# Altium project mechanical_keyboard.PrjPcb
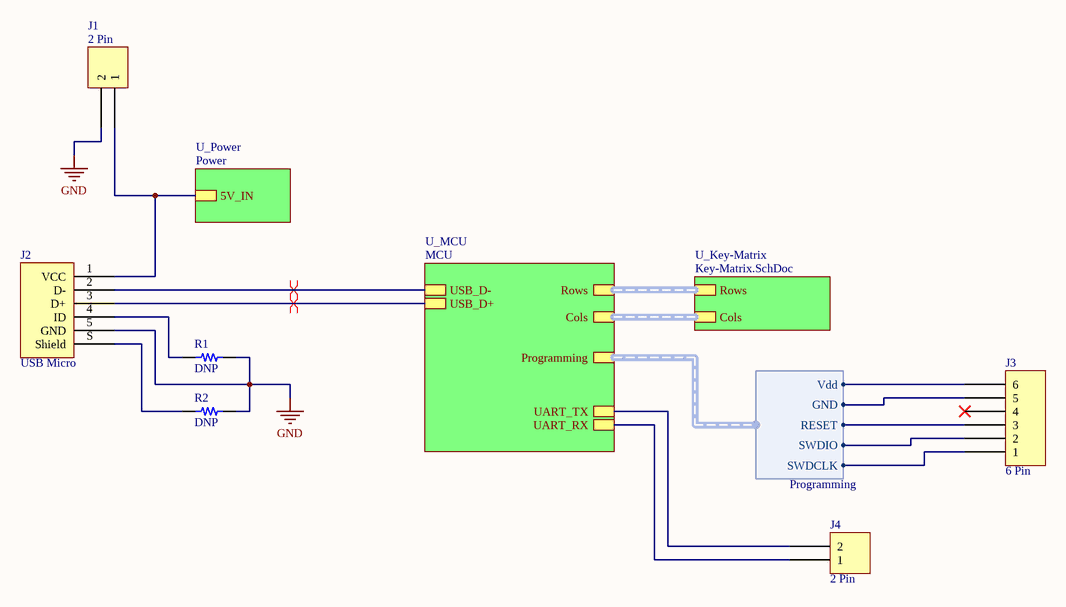
[diagram p0: Mechanical-Keyboard.SchDoc]
4 sheets, 52 parts. Net scope: hierarchical (ports join the sheet entries above them; power ports are global).
Board file: Mechanical-Keyboard.PcbDoc
Sheets:
  Mechanical-Keyboard.SchDoc
    U_MCU = MCU.SchDoc
    U_Power = Power.SchDoc
    U_Key-Matrix = Key-Matrix.SchDoc

## Sheet Mechanical-Keyboard.SchDoc
size A4; SheetTotal: 2

### Parts
J1  2 Pin  [HDR1X2]
J2  USB Micro  [FCI USB 10033526-N3212LF]
J3  6 Pin  [HDR1X6]
J4  2 Pin  [HDR1X2]
R1  DNP  [RES 0603_1608]
R2  DNP  [RES 0603_1608]

### Sub-sheets
U_Key-Matrix = Key-Matrix.SchDoc: Rows (harness Rows), Cols (harness Cols)
U_MCU = MCU: USB_D-, USB_D+, Rows (harness Rows), Cols (harness Rows), Programming (harness Programming), UART_TX, UART_RX
U_Power = Power: 5V_IN

### Harnesses
Programming: Vdd, GND, RESET, SWDIO, SWDCLK

### Nets
GND: J1.2 J2.5(GND) J3.5 R1.2 R2.2 ; sheet U_MCU/Programming.GND
Vdd: J3.6 ; sheet U_MCU/Programming.Vdd
RST: J3.3 ; sheet U_MCU/Programming.RESET
SWCLK: J3.1 ; sheet U_MCU/Programming.SWDCLK
SWDIO: J3.2 ; sheet U_MCU/Programming.SWDIO
USART3_RX: J4.1 ; sheet U_MCU/UART_RX
USART3_TX: J4.2 ; sheet U_MCU/UART_TX
USB_D_N: J2.2(D-) ; sheet U_MCU/USB_D-
USB_D_P: J2.3(D+) ; sheet U_MCU/USB_D+
NetC1_2: J1.1 J2.1(VCC) ; sheet U_Power/5V_IN
NetJ2_4: J2.4(ID) R1.1
NetJ2_S: J2.S(Shield) R2.1

Not connected (* = marked no-connect by the designer): J3 4*

### Buses and harness runs
harness sheet U_Key-Matrix/Cols = sheet U_MCU/Cols
harness sheet U_Key-Matrix/Rows = sheet U_MCU/Rows

### Layout directives
differential pair; differential pair class USB_PHY: USB_D_N, USB_D_P

### Library data of the parts
J2 = USB 2.0 Type B Micro
R1 R2 = Resistor: SMT Resistor

## Sheet MCU.SchDoc
size A4
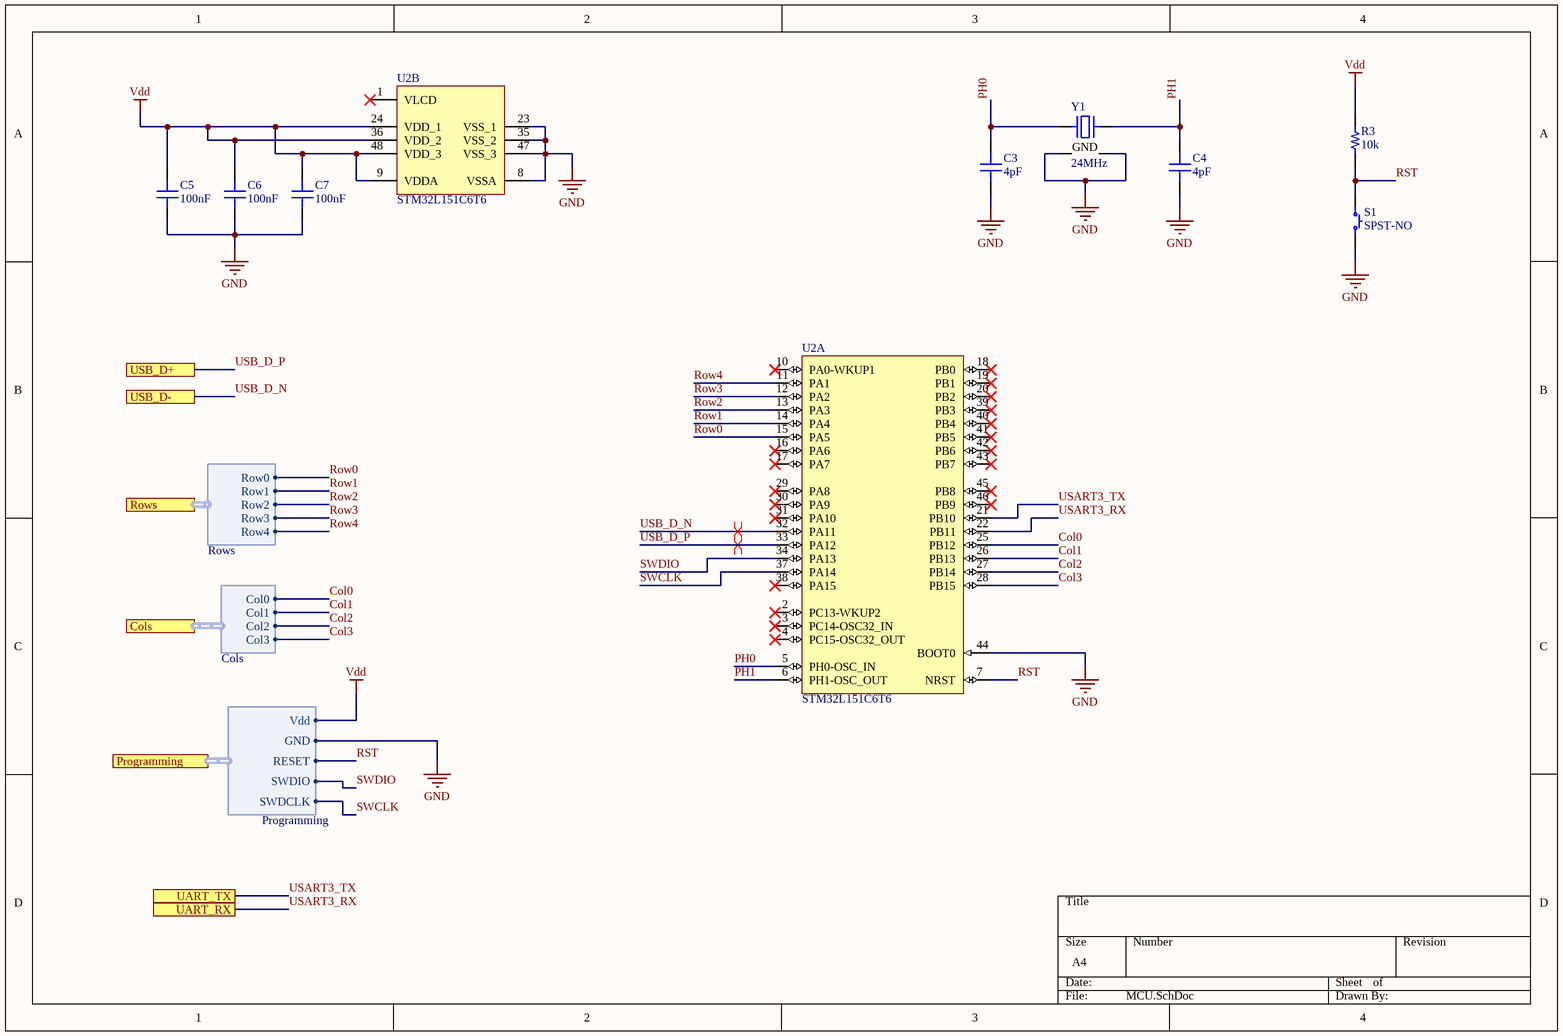
[diagram p1: MCU.SchDoc]

### Parts
C3  4pF  [CAP 0603_1608]
C4  4pF  [CAP 0603_1608]
C5  100nF  [CAP 0603_1608]
C6  100nF  [CAP 0603_1608]
C7  100nF  [CAP 0603_1608]
R3  10k  [RES 0603_1608]
S1  SPST-NO  [TE FSMSMTR]
U2  STM32L151C6T6  [STM-LQFP48_M]  (parts A,B of 2)
Y1  24MHz  [ABRACON ABM10]

### Ports
Cols (harness Cols), Programming (harness Programming), Rows (harness Rows), UART_RX, UART_TX, USB_D+, USB_D-

### Harnesses
Programming: Vdd, GND, RESET, SWDIO, SWDCLK
Rows: Row0, Row1, Row2, Row3, Row4
Cols: Col0, Col1, Col2, Col3

### Nets
GND: C3.1 C4.1 C5.1 C6.1 C7.1 S1.2 U2.8(VSSA) U2.23(VSS_1) U2.35(VSS_2) U2.44(BOOT0) U2.47(VSS_3) Y1.2(GND) Y1.4(GND) ; port Programming.GND
Vdd: C5.2 C6.2 C7.2 R3.2 U2.9(VDDA) U2.24(VDD_1) U2.36(VDD_2) U2.48(VDD_3) ; port Programming.Vdd
Col0: U2.25(PB12) ; port Cols.Col0
Col1: U2.26(PB13) ; port Cols.Col1
Col2: U2.27(PB14) ; port Cols.Col2
Col3: U2.28(PB15) ; port Cols.Col3
PH0: C3.2 U2.5(PH0-OSC_IN) Y1.1
PH1: C4.2 U2.6(PH1-OSC_OUT) Y1.3
Row0: U2.15(PA5) ; port Rows.Row0
Row1: U2.14(PA4) ; port Rows.Row1
Row2: U2.13(PA3) ; port Rows.Row2
Row3: U2.12(PA2) ; port Rows.Row3
Row4: U2.11(PA1) ; port Rows.Row4
RST: R3.1 S1.1 U2.7(NRST) ; port Programming.RESET
SWCLK: U2.37(PA14) ; port Programming.SWDCLK
SWDIO: U2.34(PA13) ; port Programming.SWDIO
USART3_RX: U2.22(PB11) ; port UART_RX
USART3_TX: U2.21(PB10) ; port UART_TX
USB_D_N: U2.32(PA11) ; port USB_D-
USB_D_P: U2.33(PA12) ; port USB_D+

Not connected (* = marked no-connect by the designer): U2 1(VLCD)* 2(PC13-WKUP2)* 3(PC14-OSC32_IN)* 4(PC15-OSC32_OUT)* 10(PA0-WKUP1)* 16(PA6)* 17(PA7)* 18(PB0)* 19(PB1)* 20(PB2)* 29(PA8)* 30(PA9)* 31(PA10)* 38(PA15)* 39(PB3)* 40(PB4)* 41(PB5)* 42(PB6)* 43(PB7)* 45(PB8)* 46(PB9)*

### Layout directives
differential pair; differential pair class USB_PHY: USB_D_N, USB_D_P

### Library data of the parts
C3-C7 = Capacitor: SMT Capacitor
R3 = Resistor: SMT Resistor
S1 = SPST-NO 2 PIN
U2 = CMP-0236-00051-2: ARM Cortex-M3 32-bit MCU, 32 KB Flash, 10 KB Internal RAM, 37 I/Os, 48-pin LQFP, -40 to 85 degC, Tray; Operating Frequency(F) (Processor speed) (MHz): 32; Data E2PROM nom (B): 4096; Internal RAM Size (kB): 10; D/A Converter: 2x12-bit (2 Channel); Supply Voltage(Vcc) min (V): 1.65; I/Os (High Current): 37; ComponentLink2Description: Datasheet; Core: ARM Cortex-M3; PackageDescription: 48-Pin Low Profile Quad Flat Package, 7 x 7 mm Body, 0.5 mm Pitch; PackageReference: LQFP48; PartNumber: STM32L151C6T6; DatasheetVersion: Rev. 8; PackageVersion: Rev. 6, 06/2013; FLASH Size (Prog) (kB): 32; ComponentLink1URL: http://www.st.com/web/en/home.html; ComponentLink3URL: http://www.st.com/st-web-ui/static/active/en/resource/technical/document/datasheet/DM00058181.pdf; ComponentLink3Description: Package Specification; Packing: Tray; ComponentLink1Description: Manufacturer URL; Mounting Technology: Surface Mount; ComponentLink2URL: http://www.st.com/st-web-ui/static/active/en/resource/technical/document/datasheet/CD00277537.pdf
Y1 = Abracon Crystal ABM10: SMT Crystal

## Sheet Power.SchDoc
size A4
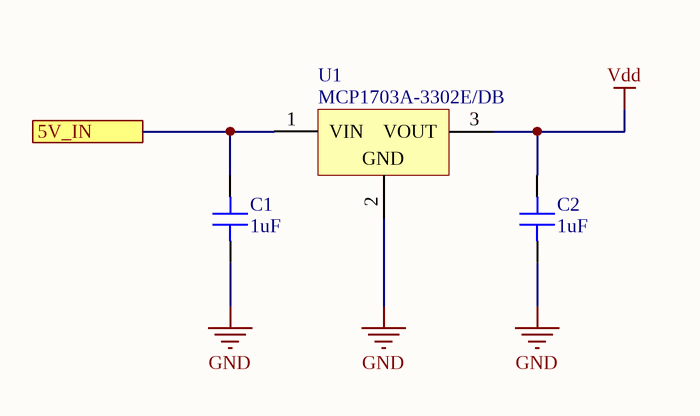
[diagram p2: Power.SchDoc]

### Parts
C1  1uF  [CAP 0603_1608]
C2  1uF  [CAP 0603_1608]
U1  MCP1703A-3302E/DB  [MCHP-SOT-223-DB3_N]

### Ports
5V_IN

### Nets
GND: C1.1 C2.1 U1.2(GND)
Vdd: C2.2 U1.3(VOUT)
NetC1_2: C1.2 U1.1(VIN) ; port 5V_IN

### Library data of the parts
C1 C2 = Capacitor: SMT Capacitor
U1 = CMP-0136-01118-1: 250 mA, 16 V, Low Quiescent Current LDO Regulator, -40 to 125 degC, 3-pin SOT-223 (DB3), Tube; Manufacturer: Microchip; ComponentLink3Description: Package Specification; PackageVersion: C04-032B; ComponentLink1URL: http://www.microchip.com; PartNumber: MCP1703A-3302E/DB; ComponentLink4URL: http://www.microchip.com/MCP1703A; PackageDescription: 3-Lead Plastic Small Outline Transistor, 6.5 x 3.5 mm Body, 2.3 mm Pitch; PackageReference: SOT-223-DB3; DatasheetVersion: Rev. A; Mounting Technology: Surface Mount; ComponentLink4Description: Product URL; ComponentLink2Description: Datasheet; ComponentLink1Description: Manufacturer URL; ComponentLink3URL: http://www.microchip.com/stellent/groups/techpub_sg/documents/packagingspec/en012702.pdf; ComponentLink2URL: http://ww1.microchip.com/downloads/en/DeviceDoc/25122A.pdf

## Sheet Key-Matrix.SchDoc
size 381 x 279 mm
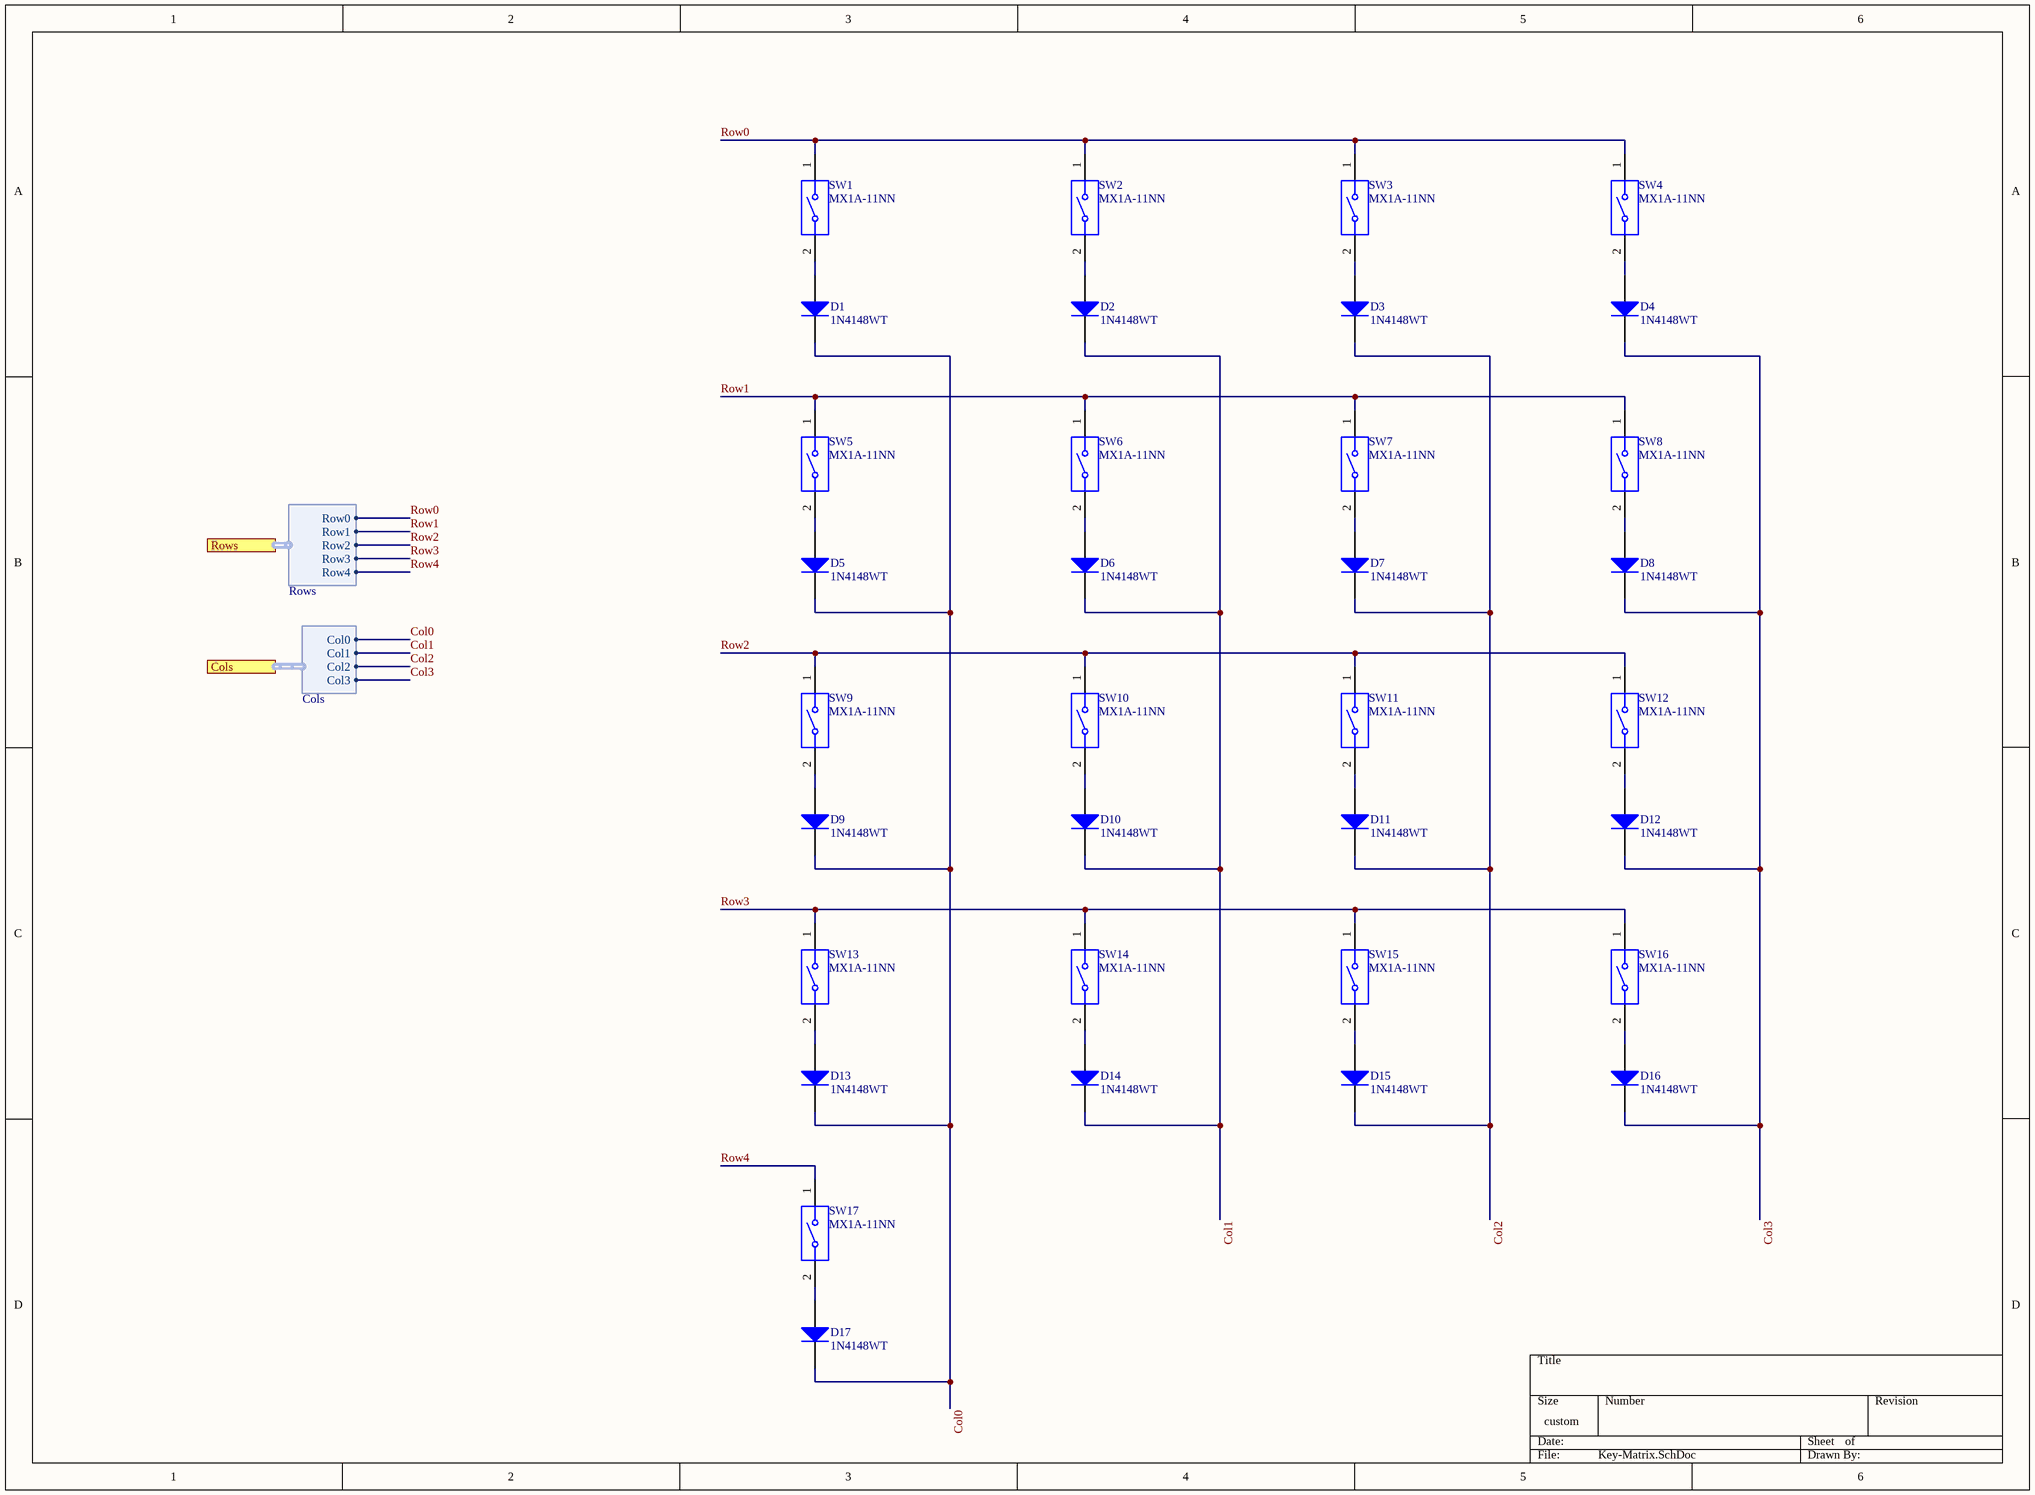
[diagram p3: Key-Matrix.SchDoc]

### Parts
D1  1N4148WT  [FAIR-SOD-523F-2_V]
D2  1N4148WT  [FAIR-SOD-523F-2_V]
D3  1N4148WT  [FAIR-SOD-523F-2_V]
D4  1N4148WT  [FAIR-SOD-523F-2_V]
D5  1N4148WT  [FAIR-SOD-523F-2_V]
D6  1N4148WT  [FAIR-SOD-523F-2_V]
D7  1N4148WT  [FAIR-SOD-523F-2_V]
D8  1N4148WT  [FAIR-SOD-523F-2_V]
D9  1N4148WT  [FAIR-SOD-523F-2_V]
D10  1N4148WT  [FAIR-SOD-523F-2_V]
D11  1N4148WT  [FAIR-SOD-523F-2_V]
D12  1N4148WT  [FAIR-SOD-523F-2_V]
D13  1N4148WT  [FAIR-SOD-523F-2_V]
D14  1N4148WT  [FAIR-SOD-523F-2_V]
D15  1N4148WT  [FAIR-SOD-523F-2_V]
D16  1N4148WT  [FAIR-SOD-523F-2_V]
D17  1N4148WT  [FAIR-SOD-523F-2_V]
SW1  MX1A-11NN  [CHRY-MX1A-11NN_V]
SW2  MX1A-11NN  [CHRY-MX1A-11NN_V]
SW3  MX1A-11NN  [CHRY-MX1A-11NN_V]
SW4  MX1A-11NN  [CHRY-MX1A-11NN_V]
SW5  MX1A-11NN  [CHRY-MX1A-11NN_V]
SW6  MX1A-11NN  [CHRY-MX1A-11NN_V]
SW7  MX1A-11NN  [CHRY-MX1A-11NN_V]
SW8  MX1A-11NN  [CHRY-MX1A-11NN_V]
SW9  MX1A-11NN  [CHRY-MX1A-11NN_V]
SW10  MX1A-11NN  [CHRY-MX1A-11NN_V]
SW11  MX1A-11NN  [CHRY-MX1A-11NN_V]
SW12  MX1A-11NN  [CHRY-MX1A-11NN_V]
SW13  MX1A-11NN  [CHRY-MX1A-11NN_V]
SW14  MX1A-11NN  [CHRY-MX1A-11NN_V]
SW15  MX1A-11NN  [CHRY-MX1A-11NN_V]
SW16  MX1A-11NN  [CHRY-MX1A-11NN_V]
SW17  MX1A-11NN  [CHRY-MX1A-11NN_V]

### Ports
Cols (harness Cols), Rows (harness Rows)

### Harnesses
Rows: Row0, Row1, Row2, Row3, Row4
Cols: Col0, Col1, Col2, Col3

### Nets
Col0: D1.1(K) D5.1(K) D9.1(K) D13.1(K) D17.1(K) ; port Cols.Col0
Col1: D2.1(K) D6.1(K) D10.1(K) D14.1(K) ; port Cols.Col1
Col2: D3.1(K) D7.1(K) D11.1(K) D15.1(K) ; port Cols.Col2
Col3: D4.1(K) D8.1(K) D12.1(K) D16.1(K) ; port Cols.Col3
Row0: SW1.1 SW2.1 SW3.1 SW4.1 ; port Rows.Row0
Row1: SW5.1 SW6.1 SW7.1 SW8.1 ; port Rows.Row1
Row2: SW9.1 SW10.1 SW11.1 SW12.1 ; port Rows.Row2
Row3: SW13.1 SW14.1 SW15.1 SW16.1 ; port Rows.Row3
Row4: SW17.1 ; port Rows.Row4
NetD1_2: D1.2(A) SW1.2
NetD2_2: D2.2(A) SW2.2
NetD3_2: D3.2(A) SW3.2
NetD4_2: D4.2(A) SW4.2
NetD5_2: D5.2(A) SW5.2
NetD6_2: D6.2(A) SW6.2
NetD7_2: D7.2(A) SW7.2
NetD8_2: D8.2(A) SW8.2
NetD9_2: D9.2(A) SW9.2
NetD10_2: D10.2(A) SW10.2
NetD11_2: D11.2(A) SW11.2
NetD12_2: D12.2(A) SW12.2
NetD13_2: D13.2(A) SW13.2
NetD14_2: D14.2(A) SW14.2
NetD15_2: D15.2(A) SW15.2
NetD16_2: D16.2(A) SW16.2
NetD17_2: D17.2(A) SW17.2

### Library data of the parts
D1-D17 = CMP-0881-00001-1: High Conductance Fast Switching Diode, 75 V, -55 to 150 degC, 2-Pin SOD523F, RoHS; Manufacturer: Fairchild Semiconductor; IR (VR: 75 V)=5 uA Max.; VF: 1 V Max.; BVR (IR: 5 uA)=75 V Min.; CO: 4 pF Max.; DatasheetVersion: Rev. A2; ComponentLink1Description: Manufacturer URL; PackageDescription: 2-Pin Surface Mount Device, Body 1.2 x 0.8 mm, Height 0.7 mm; ComponentLink2URL: http://www.fairchildsemi.com/ds/1N/1N4148WT.pdf; ComponentLink2Description: Datasheet; PartNumber: 1N4148WT; ComponentLink1URL: http://www.fairchildsemi.com/; Temperature Range: -55 to 150 degC; Mounting Technology: Surface Mount; PackageReference: SOD-523F-2; RoHS: TRUE
SW1-SW17 = CMP-2000-06785-1: Keymodule MX, SPST, IP40, 12 V Max, 10 mA Max, -10 to 70 degC, 2-Pin THD, RoHS, Bulk; Part No: MX1A11NN; Manufacturer: Cherry; Body Orientation: Straight; Total Travel: 4.06mm; Actuator Style: Button; Minimum Insulation Resistance: 100MOhm; Maximum Current Rating: 0.01A; Maximum Contact Resistance: 200mOhm; Operating Force: 0.58N; Actuator Length: 3.6mm; Maximum DC Voltage Rating: 12V; Illumination Type: N/R; Row Spacing: 6.35mm; Switch Configuration: N.O.; Electrical Life: 50000000Cycles; Type: DesktopProfile; Operating Temperature: -10to70C; Actuator Material: N/A; Supplier: CherryElectrical; Packaging: N/A; Contact Plating: N/A; Terminal Type: PCPins; Mechanical Life: N/A; Package Description: 2-Pin Through Hole Switch, Body 15.6 x 15.6 mm; Package Reference: MX1A-11NN; ECCN: EAR99; RoHS: Unknown; Contact Material: Silver/Gold; Datasheet URL: http://www.cherry.de/PDF/EN_CHERRY_MX1A-1xxx.pdf; Datasheet Version: 02/2016; Family: MX; Number of Terminals: 2; IP Rating: N/A; Pole Throw Configuration: SPST; Terminal Pitch: 2.54mm; Dielectric Strength: N/A; Actuator Color: N/A; Manufacturer URL: http://cherryswitches.com/cn/; HTS: 8536509065; Maximum Power Rating: N/A; Illumination Color: N/R; Dimension: 15.6x15.6x15.2mm; Housing Material: N/A; Maximum AC Voltage Rating: 12V; Package URL: http://cherryamericas.com/wp-content/uploads/2014/12/mx_cat.pdf; Mounting Technology: ThroughHole; Mounting: ThroughHole; Operating Speed: N/A

## Nets that join several sheets
GND: Mechanical-Keyboard (5 pins), MCU (13 pins), Power (C1.1 C2.1 U1.2)
Vdd: Mechanical-Keyboard (J3.6), MCU (8 pins), Power (C2.2 U1.3)
Col0: MCU (U2.25), Key-Matrix (5 pins)
Col1: MCU (U2.26), Key-Matrix (D2.1 D6.1 D10.1 D14.1)
Col2: MCU (U2.27), Key-Matrix (D3.1 D7.1 D11.1 D15.1)
Col3: MCU (U2.28), Key-Matrix (D4.1 D8.1 D12.1 D16.1)
NetC1_2: Mechanical-Keyboard (J1.1 J2.1), Power (C1.2 U1.1)
Row0: MCU (U2.15), Key-Matrix (SW1.1 SW2.1 SW3.1 SW4.1)
Row1: MCU (U2.14), Key-Matrix (SW5.1 SW6.1 SW7.1 SW8.1)
Row2: MCU (U2.13), Key-Matrix (SW9.1 SW10.1 SW11.1 SW12.1)
Row3: MCU (U2.12), Key-Matrix (SW13.1 SW14.1 SW15.1 SW16.1)
Row4: MCU (U2.11), Key-Matrix (SW17.1)
RST: Mechanical-Keyboard (J3.3), MCU (R3.1 S1.1 U2.7)
SWCLK: Mechanical-Keyboard (J3.1), MCU (U2.37)
SWDIO: Mechanical-Keyboard (J3.2), MCU (U2.34)
USART3_RX: Mechanical-Keyboard (J4.1), MCU (U2.22)
USART3_TX: Mechanical-Keyboard (J4.2), MCU (U2.21)
USB_D_N: Mechanical-Keyboard (J2.2), MCU (U2.32)
USB_D_P: Mechanical-Keyboard (J2.3), MCU (U2.33)